# Altium schematic sheet Sheet1_Overview.SchDoc: =ProjectName
size A4; DocumentNumber: 1; SheetNumber: 1; SheetTotal: 5
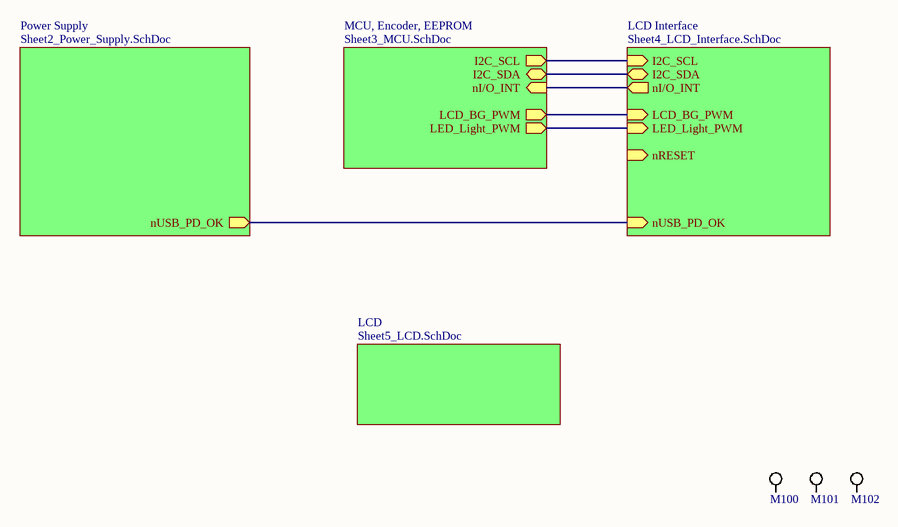
[diagram p0: Sheet1_Overview.SchDoc]

## Parts
M100  M3x8  [SCREW_M3x8_nP_FH]  (value not drawn)  (net tie, no BOM)
M101  M3x8  [SCREW_M3x8_nP_FH]  (value not drawn)  (net tie, no BOM)
M102  M3x8  [SCREW_M3x8_nP_FH]  (value not drawn)  (net tie, no BOM)

## Sub-sheets
LCD = Sheet5_LCD.SchDoc: no entries
LCD Interface = Sheet4_LCD_Interface.SchDoc: nI/O_INT (out), I2C_SCL (in), LCD_BG_PWM (in), nRESET (in), LED_Light_PWM (in), I2C_SDA (bidir), nUSB_PD_OK (in)
MCU, Encoder, EEPROM = Sheet3_MCU.SchDoc: nI/O_INT (in), I2C_SCL (out), LCD_BG_PWM (out), LED_Light_PWM (out), I2C_SDA (bidir)
Power Supply = Sheet2_Power_Supply.SchDoc: nUSB_PD_OK (out)

## Nets
(unnamed): sheet Power Supply/nUSB_PD_OK, sheet LCD Interface/nUSB_PD_OK
(unnamed): sheet MCU, Encoder, EEPROM/nI/O_INT, sheet LCD Interface/nI/O_INT
(unnamed): sheet MCU, Encoder, EEPROM/I2C_SCL, sheet LCD Interface/I2C_SCL
(unnamed): sheet MCU, Encoder, EEPROM/LCD_BG_PWM, sheet LCD Interface/LCD_BG_PWM
(unnamed): sheet MCU, Encoder, EEPROM/LED_Light_PWM, sheet LCD Interface/LED_Light_PWM
(unnamed): sheet MCU, Encoder, EEPROM/I2C_SDA, sheet LCD Interface/I2C_SDA

## Notes on the sheet
- Title
- Size:
- Date:
- A4
- Number:
- Time:
- Revision:
- Sheet
- of
- File:

## Library data of the parts
M100-M102 = SCREW_M3x8_nP_FH: Skrew M3x8 Not Plated Flathat